# Altium schematic sheet BOARD_POWER.SchDoc: BOARD Power
size A4; Date: Not used; ApprovedBy: Not used; CheckedBy: Not used; Author: Not used; CompanyName: STMicroelectronics; DrawnBy: Not used; Engineer: Not used; Organization: Not used; Address1: Not used; Address2: Not used; Address3: Not used; Address4: Not used; DocumentNumber: Not used; Revision: Not used; SheetNumber: 14; SheetTotal: 16; CurrentTime: Not used; CurrentDate: Not used; Time: Not used; DocumentFullPathAndName: Not used; DocumentName: Not used; ModifiedDate: Not used; ImagePath: Not used; ProjectName: Not used; Application_BuildNumber: Not used
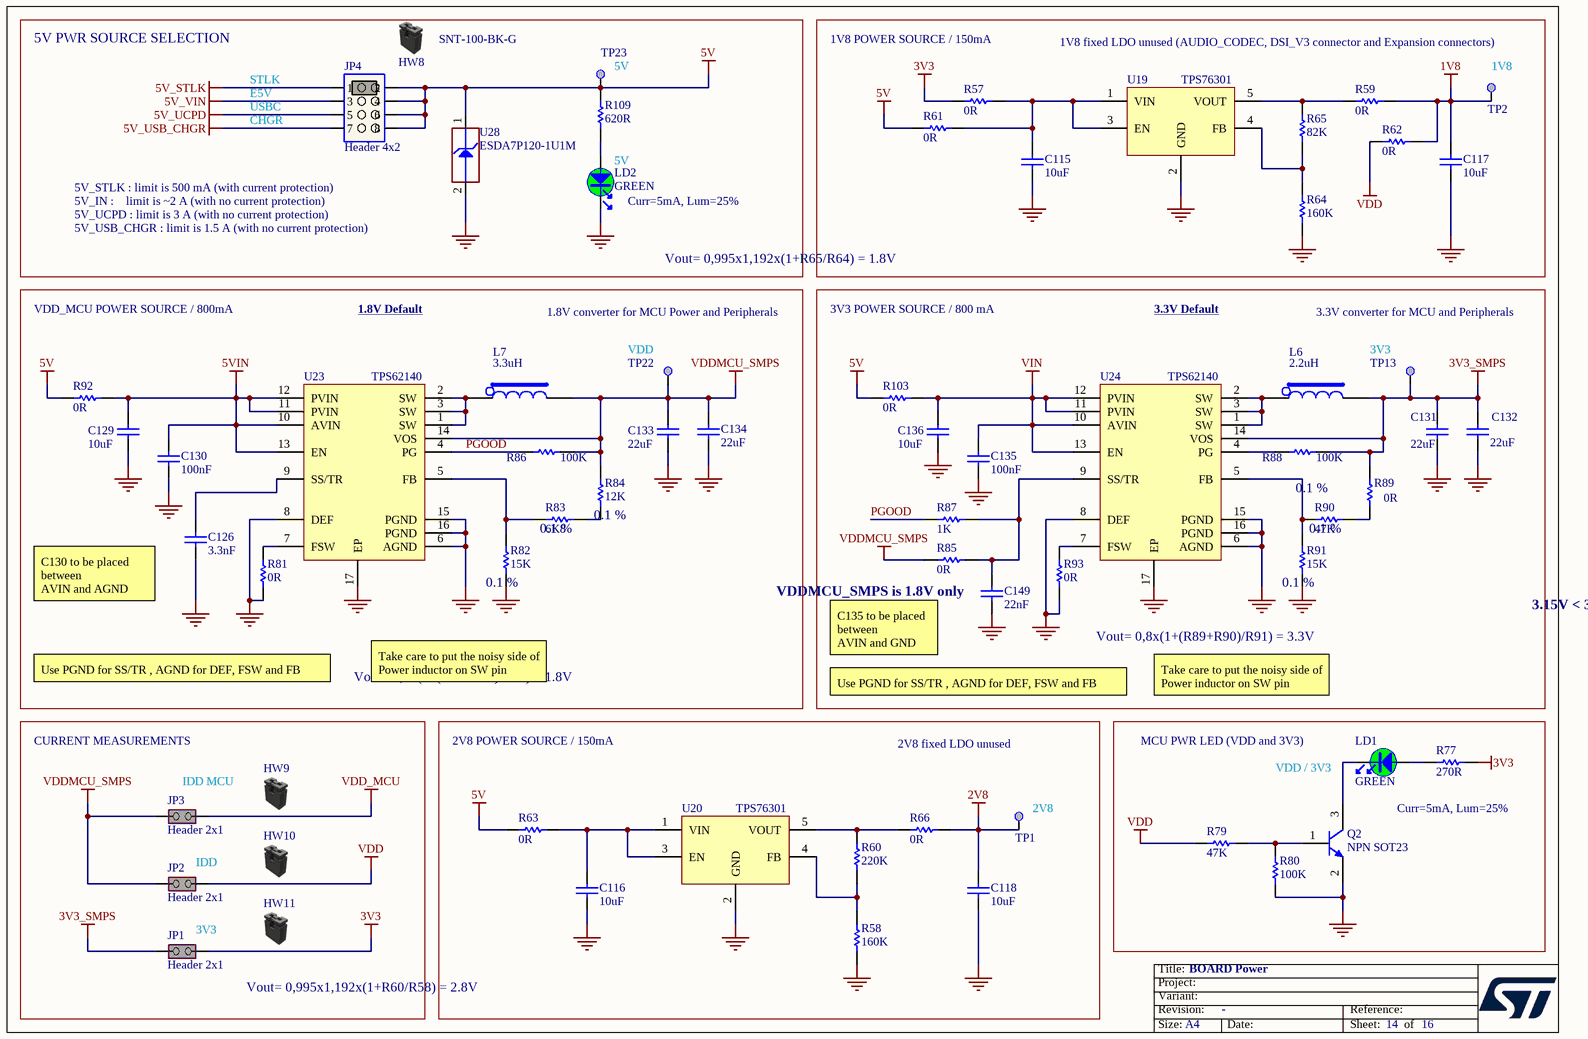
[diagram p0: BOARD_POWER.SchDoc]

## Parts
C115  value 10uF  [C0603_H0P8]  (hidden comment: Capacitor)
C116  value 10uF  [C0603_H0P8]  (hidden comment: Capacitor)
C117  value 10uF  [C0603_H0P8]  (hidden comment: Capacitor)
C118  value 10uF  [C0603_H0P8]  (hidden comment: Capacitor)
C126  value 3.3nF  [C0402]  (hidden comment: Capacitor)
C129  value 10uF  [C1206_H1P6]  (hidden comment: Capacitor)
C130  value 100nF  [C0402]  (hidden comment: Capacitor)
C131  value 22uF  [C0603_H0P8]  (hidden comment: Capacitor)
C132  value 22uF  [C0603_H0P8]  (hidden comment: Capacitor)
C133  value 22uF  [C0603_H0P8]  (hidden comment: Capacitor)
C134  value 22uF  [C0603_H0P8]  (hidden comment: Capacitor)
C135  value 100nF  [C0402]  (hidden comment: Capacitor)
C136  value 10uF  [C1206_H1P6]  (hidden comment: Capacitor)
C149  value 22nF  [C0402]  (hidden comment: Capacitor)
HW8  value SNT-100-BK-G  (hidden comment: Shunt Black 2.54mm)  (mechanical)
HW9  Shunt Black 2.54mm  (value not drawn)  (mechanical)
HW10  Shunt Black 2.54mm  (value not drawn)  (mechanical)
HW11  Shunt Black 2.54mm  (value not drawn)  (mechanical)
JP1  value Header 2x1  [CON_SAMTEC_TSW-102-07-G-S]  (hidden comment: Jumper_Header 2x1 Fitted)
JP2  value Header 2x1  [CON_SAMTEC_TSW-102-07-G-S]  (hidden comment: Jumper_Header 2x1 Fitted)
JP3  value Header 2x1  [CON_SAMTEC_TSW-102-07-G-S]  (hidden comment: Jumper_Header 2x1 Fitted)
JP4  value Header 4x2  [CON_SAMTEC_TSW-104-07-X-D]  (hidden comment: Jumper_Header 4x2 Fitted 1-2)
L6  value 2.2uH  [IND_COILCRAFT_XGL4020]  (hidden comment: INDUCTOR_POWER_WINDING)
L7  value 3.3uH  [IND_COILCRAFT_XGL4020]  (hidden comment: INDUCTOR_POWER_WINDING)
LD1  value GREEN  [LED_0603_OSRAM_LG-Q396-PS-35_GREEN_1A2K_H0P4]  (hidden comment: LED_green)
LD2  value GREEN  [LED_0603_OSRAM_LG-Q396-PS-35_GREEN_1A2K_H0P4]  (hidden comment: LED_green)
Q2  value NPN SOT23  [NPN_SOT23]  (hidden comment: 9013-SOT23)
R57  value 0R  [R0402]  (hidden comment: Resistor)
R58  value 160K  [R0402]  (hidden comment: Resistor)
R59  value 0R  [R0603]  (hidden comment: Resistor)
R60  value 220K  [R0402]  (hidden comment: Resistor)
R61  value 0R  [R0402]  (hidden comment: Resistor)
R62  value 0R  [R0603]  (hidden comment: Resistor)
R63  value 0R  [R0402]  (hidden comment: Resistor)
R64  value 160K  [R0402]  (hidden comment: Resistor)
R65  value 82K  [R0402]  (hidden comment: Resistor)
R66  value 0R  [R0603]  (hidden comment: Resistor)
R77  value 270R  [R0402]  (hidden comment: Resistor)
R79  value 47K  [R0603]  (hidden comment: Resistor)
R80  value 100K  [R0603]  (hidden comment: Resistor)
R81  value 0R  [R0402]  (hidden comment: Resistor)
R82  value 15K  [R0402]  (hidden comment: Resistor)
R83  value 6K8  [R0402]  (hidden comment: Resistor)
R84  value 12K  [R0402]  (hidden comment: Resistor)
R85  value 0R  [R0402]  (hidden comment: Resistor)
R86  value 100K  [R0402]  (hidden comment: Resistor)
R87  value 1K  [R0402]  (hidden comment: Resistor)
R88  value 100K  [R0402]  (hidden comment: Resistor)
R89  value 0R  [R0402]  (hidden comment: Resistor)
R90  value 47K  [R0402]  (hidden comment: Resistor)
R91  value 15K  [R0402]  (hidden comment: Resistor)
R92  value 0R  [R0603]  (hidden comment: Resistor)
R93  value 0R  [R0402]  (hidden comment: Resistor)
R103  value 0R  [R0603]  (hidden comment: Resistor)
R109  value 620R  [R0402]  (hidden comment: Resistor)
TP1  Test Point  [TP_SMD_1MM]  (value not drawn)  (no BOM)
TP2  Test Point  [TP_SMD_1MM]  (value not drawn)  (no BOM)
TP13  Test Point  [TP_SMD_1MM]  (value not drawn)  (no BOM)
TP22  Test Point  [TP_SMD_1MM]  (value not drawn)  (no BOM)
TP23  Test Point  [TP_SMD_1MM]  (value not drawn)  (no BOM)
U19  TPS76301  [ICC_SOT23-5L_H1P45]
U20  TPS76301  [ICC_SOT23-5L_H1P45]
U23  value TPS62140  [ICC_VQFN16-EPAD_3X3_P050]  (hidden comment: TPS62140RGTR)
U24  value TPS62140  [ICC_VQFN16-EPAD_3X3_P050]  (hidden comment: TPS62140RGTR)
U28  value ESDA7P120-1U1M  [ESD_QFN1610_2N_1K_2A]  (hidden comment: ESD-TRANSIL)

## Blocks framed on the sheet
5V PWR SOURCE SELECTION: JP4 LD2 R109 TP23 U28
Vout= 0,995x1,192x(1+R65/R64) = 1.8V: C115 C117 R57 R59 R61 R62 R64 R65 TP2 U19
VDDMCU_SMPS is 1.8V only: C126 C129 C130 C133 C134 L7 R81-R84 R86 R92 TP22 U23
3.15V < 3V3_SMPS typ. < 3.6V: C131 C132 C135 C136 C149 L6 R85 R87-R91 R93 R103 TP13 U24
Vout= 0,995x1,192x(1+R60/R58) = 2.8V: C116 C118 R58 R60 R63 R66 TP1 U20

## Nets
1V8: C117.2 R59.2 R62.2 TP2.1
2V8: C118.2 R66.2 TP1.1
3V3: JP1.2(NO) R57.1 R77.2
3V3_SMPS: C131.1 C132.2 JP1.1(COMMON) L6.2 R88.2 R89.2 TP13.1 U24.14(VOS)
5V: JP4.2 JP4.4 JP4.6 JP4.8 R61.1 R63.1 R92.1 R103.1 R109.2 TP23.1 U28.1(IO1)
5V_STLK: JP4.1
5V_UCPD: JP4.5
5V_USB_CHGR: JP4.7
5V_VIN: JP4.3
5VIN: C129.2 C130.2 R92.2 U23.10(AVIN) U23.11(PVIN) U23.12(PVIN) U23.13(EN)
GND: C115.1 C116.1 C117.1 C118.1 C126.1 C129.1 C130.1 C131.2 C132.1 C133.1 C134.1 C135.1 C136.1 C149.1 LD2.2 Q2.2(E) R58.1 R64.1 R80.1 R81.1 R82.1 R91.1 R93.1 U19.2(GND) U20.2(GND) U23.6(AGND) U23.8(DEF) U23.15(PGND) U23.16(PGND) U23.17(EP) U24.6(AGND) U24.8(DEF) U24.15(PGND) U24.16(PGND) U24.17(EP) U28.2(GND)
VDD: JP2.2(NO) R62.1 R79.1
VDD_MCU: JP3.2(NO)
VDDMCU_SMPS: C133.2 C134.2 JP2.1(COMMON) JP3.1(COMMON) L7.2 R84.1 R85.2 R86.2 TP22.1 U23.14(VOS)
VIN: C135.2 C136.2 R103.2 U24.10(AVIN) U24.11(PVIN) U24.12(PVIN) U24.13(EN)
PGOOD: R86.1 R87.2 U23.4(PG)
NetC115_2: C115.2 R57.2 R61.2 U19.1(VIN) U19.3(EN)
NetC116_2: C116.2 R63.2 U20.1(VIN) U20.3(EN)
NetC126_2: C126.2 U23.9(SS/TR)
NetC149_2: C149.2 R85.1 R87.1 U24.9(SS/TR)
NetL6_1: L6.1 U24.1(SW) U24.2(SW) U24.3(SW)
NetL7_1: L7.1 U23.1(SW) U23.2(SW) U23.3(SW)
NetLD1_1: LD1.1 R77.1
NetLD1_2: LD1.2 Q2.3(C)
NetLD2_1: LD2.1 R109.1
NetQ2_1: Q2.1(B) R79.2 R80.2
NetR58_2: R58.2 R60.1 U20.4(FB)
NetR59_1: R59.1 R65.2 U19.5(VOUT)
NetR60_2: R60.2 R66.1 U20.5(VOUT)
NetR64_2: R64.2 R65.1 U19.4(FB)
NetR81_2: R81.2 U23.7(FSW)
NetR82_2: R82.2 R83.1 U23.5(FB)
NetR83_2: R83.2 R84.2
NetR88_1: R88.1 U24.4(PG)
NetR89_1: R89.1 R90.2
NetR90_1: R90.1 R91.2 U24.5(FB)
NetR93_2: R93.2 U24.7(FSW)

## Notes on the sheet
- 1V8 POWER SOURCE / 150mA
- 1V8 fixed LDO unused (AUDIO_CODEC, DSI_V3 connector and Expansion connectors)
- STLK
- E5V
- USBC
- (near TP23) 5V
- (near TP2) 1V8
- CHGR
- (near LD2) 5V
- 5V_STLK : limit is 500 mA (with current protection)
- 5V_IN :    limit is ~2 A (with no current protection)
- 5V_UCPD : limit is 3 A (with no current protection)
- 5V_USB_CHGR : limit is 1.5 A (with no current protection)
- (near LD2) Curr=5mA, Lum=25%
- VDD_MCU POWER SOURCE / 800mA
- 1.8V Default
- 1.8V converter for MCU Power and Peripherals
- 3V3 POWER SOURCE / 800 mA
- 3.3V Default
- 3.3V converter for MCU and Peripherals
- (near TP22) VDD
- (near TP13) 3V3
- (near R83) 0.1 %
- (near R84) 0.1 %
- (near R89) 0.1 %
- (near R90) 0.1 %
- (near R82) 0.1 %
- (near R91) 0.1 %
- (near C126) C130 to be placed between
  AVIN and AGND
- C135 to be placed between
  AVIN and GND
- Vout= 0,8x(1+(R89+R90)/R91) = 3.3V
- Use PGND for SS/TR , AGND for DEF, FSW and FB
- Take care to put the noisy side of Power inductor on SW pin
- Vout= 0,8x(1+(R83+R84)/R82) = 1.8V
- CURRENT MEASUREMENTS
- IDD MCU
- 2V8 POWER SOURCE / 150mA
- 2V8 fixed LDO unused
- MCU PWR LED (VDD and 3V3)
- VDD / 3V3
- (near TP1) 2V8
- Curr=5mA, Lum=25%
- (near JP2) IDD
- (near JP1) 3V3
- Title:
- Project:
- Size:
- Revision:
- Variant:
- A4
- -
- Date:
- Reference:
- Sheet:
- of

## Library data of the parts
C115-C118 = MCD-02605: Capacitor, MLCC, 10uF, 10V, X5R, +/-10%, 0603, T=0.8mm; Part_Preference: Recommended; Manufacturer: YAGEO; Manufacturer_Part_Number: CC0603KRX5R6BB106; Order_Code_RS: 2006536; Internal_Part_Number: MCD-02605; Status: Checked; Part_Type: Capacitor; Package: 0603; ComponentLink1URL: http://tunmcdsvn.tun.st.com/Component_Documentation_Library/Trunk/Capacitor/YAGEO_X5R_Series; Order_Code_Digikey: 311-1782-2-ND; Order_Code_Farnell: 3759761
C126 = MCD-02628: Capacitor, MLCC, 3.3nF, 50V, X7R, +/-10%, 0402, T=0.5mm; Part_Preference: Recommended; Manufacturer: YAGEO; Manufacturer_Part_Number: CC0402KRX7R9BB332; Order_Code_RS: 1992260; Internal_Part_Number: MCD-02628; Status: New; Part_Type: Capacitor; Package: 0402; ComponentLink1URL: http://tunmcdsvn.tun.st.com/Component_Documentation_Library/Trunk/Capacitor/YAGEO_X7R_Series; Order_Code_Digikey: 311-1034-2-ND; Order_Code_Farnell: 2370654
C129 C136 = MCD-02610: Capacitor, MLCC, 10uF, 25V, X5R, +/-10%, 1206, T=1.6mm; Part_Preference: Recommended; Manufacturer: YAGEO; Manufacturer_Part_Number: CC1206KKX5R8BB106; Order_Code_RS: 1991983; Internal_Part_Number: MCD-02610; Status: Checked; Part_Type: Capacitor; Package: 1206; ComponentLink1URL: http://tunmcdsvn.tun.st.com/Component_Documentation_Library/Trunk/Capacitor/YAGEO_X5R_Series; Order_Code_Digikey: N/A; Order_Code_Farnell: 3366655
C130 C135 = MCD-00006: Capacitor, MLCC, 100nF, 16V, X7R, +/-10%, 0402, T=0.5mm; Part_Preference: Recommended; Manufacturer: YAGEO; Manufacturer_Part_Number: CC0402KRX7R7BB104; Order_Code_RS: 616-9701; Component_Country_Of_Origin: China; Internal_Part_Number: MCD-00006; Status: Released; Part_Type: Capacitor; Package: 0402; ComponentLink1URL: http://tunmcdsvn.tun.st.com/Component_Documentation_Library/Trunk/Capacitor/YAGEO_X7R_Series; Order_Code_Digikey: 311-1338-1-ND; Order_Code_Farnell: 9402047
C131-C134 = MCD-02607: Capacitor, MLCC, 22uF, 10V, X5R, +/-20%, 0603, T=0.8mm; Part_Preference: Recommended; Manufacturer: YAGEO; Manufacturer_Part_Number: CC0603MRX5R6BB226; Order_Code_RS: 2006627; Internal_Part_Number: MCD-02607; Status: Checked; Part_Type: Capacitor; Package: 0603; ComponentLink1URL: http://tunmcdsvn.tun.st.com/Component_Documentation_Library/Trunk/Capacitor/YAGEO_X5R_Series; Order_Code_Digikey: 311-1819-2-ND; Order_Code_Farnell: N/A
C149 = MCD-03051: Capacitor, MLCC, 22nF, 50V, X7R, +/-10%, 0402, T=0.5mm; Part_Preference: Recommended; Manufacturer: YAGEO; Manufacturer_Part_Number: CC0402KRX7R9BB223; Order_Code_RS: NA; ShowFields: YES; ID: 5167; Internal_Part_Number: MCD-03051; Status: New; Part_Type: Capacitor; Package: 0402; ComponentLink1URL: http://tunmcdsvn.tun.st.com/Component_Documentation_Library/Trunk/Capacitor/YAGEO_X7R_Series; Order_Code_Digikey: 311-1722-2-ND; Order_Code_Farnell: 3366470
HW8 = MCD-00043: SHUNT 2.54mm BLACK; Part_Type: Misc; Manufacturer: SAMTEC; Part_Preference: Recommended; Component_Country_Of_Origin: China, Costa Rica, Malaysia, United States, Vietnam; Internal_Part_Number: MCD-00043; Status: Released; Manufacturer_Part_Number: SNT-100-BK-G; ComponentLink1URL: http://tunmcdsvn.tun.st.com/Component_Datasheet_Library/Trunk/Connectors/Samtec_Shunt_Jumper_SNT100
HW9-HW11 = MCD-00043: SHUNT 2.54mm BLACK; Part_Type: Misc; Manufacturer: SAMTEC; Part_Preference: Recommended; Value: SNT-100-BK-G; Component_Country_Of_Origin: China, Costa Rica, Malaysia, United States, Vietnam; Internal_Part_Number: MCD-00043; Status: Released; Manufacturer_Part_Number: SNT-100-BK-G; ComponentLink1URL: http://tunmcdsvn.tun.st.com/Component_Datasheet_Library/Trunk/Connectors/Samtec_Shunt_Jumper_SNT100
JP1-JP3 = MCD-00683: Header, 2x1, 2.54mm, VR, TH, T=5.84mm/2.54mm; Part_Type: Connector; Manufacturer: SAMTEC; Manufacturer_Part_Number: TSW-102-07-G-S; Part_Preference: Recommended; Order_Code_RS: 155-5312; Component_Country_Of_Origin: China, Costa Rica, Malaysia, United States, Vietnam; Internal_Part_Number: MCD-00683; Status: Released; ComponentLink1URL: http://tunmcdsvn.tun.st.com/Component_Documentation_Library/Trunk/Connector/SAMTEC_TSW_Series/; Order_Code_Digikey: SAM1029-02-ND; Order_Code_Farnell: 2505044
JP4 = MCD-00686: Header, 4x2, 2.54mm, VR, TH, T=5.84mm/2.54mm; Part_Type: Connector; Manufacturer_Part_Number: TSW-104-07-G-D; Manufacturer: SAMTEC; Part_Preference: Recommended; Order_Code_RS: 161-2260; Component_Country_Of_Origin: China, Costa Rica, Malaysia, United States, Vietnam; Internal_Part_Number: MCD-00686; Status: Released; ComponentLink1URL: http://tunmcdsvn.tun.st.com/Component_Documentation_Library/Trunk/Connector/SAMTEC_TSW_Series/; Order_Code_Digikey: SAM1028-04-ND; Order_Code_Farnell: 2856692
L6 = MCD-02582: Inductor, 2.2uH, +/-20%, 8.9A, 0R022, 4x4mm, T=2.1mm; Part_Preference: Recommended; Manufacturer: COILCRAFT; Manufacturer_Part_Number: XGL4020-222MED; ShowFields: YES; ID: 4688; Internal_Part_Number: MCD-02582; Status: Checked; Part_Type: Inductor; ComponentLink1URL: http://tunmcdsvn.tun.st.com/Component_Documentation_Library/Trunk/Inductor/COILCRAFT_XGL4020_Series; Order_Code_Digikey: N/A; Order_Code_Farnell: N/A; Order_Code_RS: N/A
L7 = MCD-02581: Inductor, 3.3uH, +/-20%, 6.6A, 0R034, 4x4mm, T=2.1mm; Part_Preference: Recommended; Manufacturer: COILCRAFT; Manufacturer_Part_Number: XGL4020-332MED; ShowFields: YES; ID: 4687; Internal_Part_Number: MCD-02581; Status: Checked; Part_Type: Inductor; ComponentLink1URL: http://tunmcdsvn.tun.st.com/Component_Documentation_Library/Trunk/Inductor/COILCRAFT_XGL4020_Series; Order_Code_Digikey: N/A; Order_Code_Farnell: N/A; Order_Code_RS: N/A
LD1 LD2 = MCD-00588: LED Green, 0603 SMD, Forward Voltage Typ=2V, Max=2.5V; Part_Type: Display; Manufacturer: OSRAM OPTO SEMICONDUCTORS; Manufacturer_Part_Number: LG Q396-PS-35; Part_Preference: Recommended; Alternate_Internal_Part_Number: MCD-02400; Component_Country_Of_Origin: Unknown; ShowFields: YES; ID: 3155; Internal_Part_Number: MCD-00588; Status: Released; Package: LED 0603; ComponentLink1URL: http://tunmcdsvn.tun.st.com/Component_Datasheet_Library/Trunk/Display/OSRAM_LED_GREEN_LG Q396-PS-35; Order_Code_Digikey: LG Q396-PS-35-ND
Q2 = MCD-00073: NPN Bipolar Transistor; Part_Type: IC; Manufacturer_Part_Number: BSR14; Manufacturer: ON SEMICONDUCTOR; Part_Preference: Recommended; Component_Country_Of_Origin: Unknown; Revision: *; Internal_Part_Number: MCD-00073; Status: Released; ComponentLink1URL: http://tunmcdsvn.tun.st.com/Component_Datasheet_Library/Trunk/IC/NXP_Transistor_BSR14; Package: SOT23
R57 R61 R63 R81 R85 R93 = MCD-00052: Resistor, 0R, 0402, +/-5%, 1/16W; Part_Preference: Recommended; Manufacturer: YAGEO; Manufacturer_Part_Number: RC0402JR-070RL; Order_Code_RS: 618-5804; Component_Country_Of_Origin: China; Internal_Part_Number: MCD-00052; Status: Released; Part_Type: Resistor; Package: 0402; ComponentLink1URL: http://tunmcdsvn.tun.st.com/Component_Documentation_Library/Trunk/Resistor/YAGEO_RC_L_Series; Order_Code_Digikey: 311-0.0JRCT-ND; Order_Code_Farnell: 9232516RL
R58 R64 = MCD-00405: Resistor, 160K, 0402, +/-1%, 1/16W; Part_Preference: Recommended; Manufacturer: YAGEO; Manufacturer_Part_Number: RC0402FR-07160KL; Component_Country_Of_Origin: China; Internal_Part_Number: MCD-00405; Status: Released; Part_Type: Resistor; Package: 0402; ComponentLink1URL: http://tunmcdsvn.tun.st.com/Component_Documentation_Library/Trunk/Resistor/YAGEO_RC_L_Series; Order_Code_Digikey: YAG2996CT-ND; Order_Code_Farnell: 2140947; Order_Code_RS: N/A
R59 R62 R66 R92 R103 = MCD-00181: Resistor, 0R, 0603, +/- 0.5mR, 1/4W; Part_Preference: Recommended; Manufacturer: ROHM; Manufacturer_Part_Number: PMR03EZPJ000; Component_Country_Of_Origin: Philippines, Thailand; Internal_Part_Number: MCD-00181; Status: Released; Part_Type: Resistor; Package: 0603; ComponentLink1URL: http://tunmcdsvn.tun.st.com/Component_Documentation_Library/Trunk/Resistor/ROHM_PMR_Series; Order_Code_Digikey: PMR03EZPJ000-ND; Order_Code_Farnell: N/A; Order_Code_RS: N/A
R60 = MCD-00164: Resistor, 220K, 0402, +/-1%, 1/16W; Part_Preference: Recommended; Manufacturer: YAGEO; Manufacturer_Part_Number: RC0402FR-07220KL; Component_Country_Of_Origin: China; Internal_Part_Number: MCD-00164; Status: Released; Part_Type: Resistor; Package: 0402; ComponentLink1URL: http://tunmcdsvn.tun.st.com/Component_Documentation_Library/Trunk/Resistor/YAGEO_RC_L_Series; Order_Code_Digikey: 311-220KLRCT-ND; Order_Code_Farnell: 9239510; Order_Code_RS: N/A
R65 = MCD-00531: Resistor, 82K, 0402, +/-1%, 1/16W; Part_Preference: Recommended; Manufacturer: YAGEO; Manufacturer_Part_Number: RC0402FR-0782KL; Component_Country_Of_Origin: China; Internal_Part_Number: MCD-00531; Status: Released; Part_Type: Resistor; Package: 0402; ComponentLink1URL: http://tunmcdsvn.tun.st.com/Component_Documentation_Library/Trunk/Resistor/YAGEO_RC_L_Series; Order_Code_Digikey: 311-82.0KLRCT-ND; Order_Code_Farnell: 9239464; Order_Code_RS: N/A
R77 = MCD-00441: Resistor, 270R, 0402, +/-1%, 1/16W; Manufacturer: YAGEO; Manufacturer_Part_Number: RC0402FR-07270RL; Part_Preference: Recommended; Component_Country_Of_Origin: China; ShowFields: YES; ID: 2838; Internal_Part_Number: MCD-00441; Status: Released; Part_Type: Resistor; Package: 0402; ComponentLink1URL: http://tunmcdsvn.tun.st.com/Component_Documentation_Library/Trunk/Resistor/YAGEO_RC_L_Series; Order_Code_Digikey: 311-270LRCT-ND; Order_Code_Farnell: 9239162; Order_Code_RS: N/A
R79 = MCD-00222: Resistor, 47K, 0603, 1%, 1/10W; Manufacturer_Part_Number: RC0603FR-0747KL; Manufacturer: YAGEO; Part_Preference: Recommended; Component_Country_Of_Origin: China; Internal_Part_Number: MCD-00222; Status: Released; Part_Type: Resistor; Package: 0603; ComponentLink1URL: http://tunmcdsvn.tun.st.com/Component_Documentation_Library/Trunk/Resistor/YAGEO_RC_L_Series; Order_Code_Digikey: 311-47.0KHRCT-ND; Order_Code_Farnell: 9238689; Order_Code_RS: N/A
R80 = MCD-00223: Resistor, 100K, 0603, +/- 1%, 1/10W; Manufacturer_Part_Number: RC0603FR-07100KL; Manufacturer: YAGEO; Part_Preference: Recommended; Component_Country_Of_Origin: China; Internal_Part_Number: MCD-00223; Status: Released; Part_Type: Resistor; Package: 0603; ComponentLink1URL: http://tunmcdsvn.tun.st.com/Component_Documentation_Library/Trunk/Resistor/YAGEO_RC_L_Series; Order_Code_Digikey: 311-100KHRTR-ND; Order_Code_Farnell: 2421851; Order_Code_RS: N/A
R82 R91 = MCD-02570: Resistor, 15K, 0402, +/-0.1%, 1/16W, +/-25ppm/°C; Part_Preference: Recommended; Manufacturer: YAGEO; Manufacturer_Part_Number: RT0402BRD0715KL; Order_Code_RS: 1991284; Internal_Part_Number: MCD-02570; Status: Checked; Part_Type: Resistor; Package: 0402; ComponentLink1URL: http://tunmcdsvn.tun.st.com/Component_Documentation_Library/Trunk/Resistor/YAGEO_RT_Series/; Order_Code_Digikey: YAG2302TR-ND; Order_Code_Farnell: 3496464
R83 = MCD-02568: Resistor, 6K8, 0402, +/-0.1%, 1/16W, +/-25ppm/°C; Part_Preference: Recommended; Manufacturer: YAGEO; Manufacturer_Part_Number: RT0402BRD076K8L; Order_Code_RS: 1991364; Internal_Part_Number: MCD-02568; Status: Checked; Part_Type: Resistor; Package: 0402; ComponentLink1URL: http://tunmcdsvn.tun.st.com/Component_Documentation_Library/Trunk/Resistor/YAGEO_RT_Series/; Order_Code_Digikey: YAG1473TR-ND; Order_Code_Farnell: 3496534RL
R84 = MCD-02567: Resistor, 12K, 0402, +/-0.1%, 1/16W, +/-25ppm/°C; Part_Preference: Recommended; Manufacturer: YAGEO; Manufacturer_Part_Number: RT0402BRD0712KL; Internal_Part_Number: MCD-02567; Status: Checked; Part_Type: Resistor; Package: 0402; ComponentLink1URL: http://tunmcdsvn.tun.st.com/Component_Documentation_Library/Trunk/Resistor/YAGEO_RT_Series/; Order_Code_Digikey: YAG1354TR-ND; Order_Code_Farnell: 3496461RL; Order_Code_RS: N/A
R86 R88 = MCD-00059: Resistor, 100K, 0402, +/-1%, 1/16W; Part_Preference: Recommended; Manufacturer: YAGEO; Manufacturer_Part_Number: RC0402FR-07100KL; Component_Country_Of_Origin: China; Internal_Part_Number: MCD-00059; Status: Released; Part_Type: Resistor; Package: 0402; ComponentLink1URL: http://tunmcdsvn.tun.st.com/Component_Documentation_Library/Trunk/Resistor/YAGEO_RC_L_Series; Order_Code_Digikey: 311-100KLRTR-ND; Order_Code_Farnell: 2421891; Order_Code_RS: N/A
R87 = MCD-00061: Resistor, 1K, 0402, +/-1%,1/16W; Part_Preference: Recommended; Manufacturer: YAGEO; Manufacturer_Part_Number: RC0402FR-071KL; Component_Country_Of_Origin: China; ShowFields: YES; ID: 2532; Internal_Part_Number: MCD-00061; Status: Released; Part_Type: Resistor; Package: 0402; ComponentLink1URL: http://tunmcdsvn.tun.st.com/Component_Documentation_Library/Trunk/Resistor/YAGEO_RC_L_Series; Order_Code_Digikey: 311-1.00KLRCT-ND; Order_Code_Farnell: 9239235; Order_Code_RS: N/A
R89 = MCD-00052: Resistor, 0R, 0402, +/-5%, 1/16W; Part_Preference: Recommended; Manufacturer: YAGEO; Manufacturer_Part_Number: RC0402JR-070RL; Order_Code_RS: 618-5804; Component_Country_Of_Origin: China; ShowFields: YES; ID: 2540; Internal_Part_Number: MCD-00052; Status: Released; Part_Type: Resistor; Package: 0402; ComponentLink1URL: http://tunmcdsvn.tun.st.com/Component_Documentation_Library/Trunk/Resistor/YAGEO_RC_L_Series; Order_Code_Digikey: 311-0.0JRCT-ND; Order_Code_Farnell: 9232516RL
R90 = MCD-02550: Resistor, 47K, 0402, +/-0.1%, 1/16W, +/-25ppm/°C; Part_Preference: Recommended; Manufacturer: YAGEO; Manufacturer_Part_Number: RT0402BRD0747KL; Order_Code_RS: 1991342; Internal_Part_Number: MCD-02550; Status: Checked; Part_Type: Resistor; Package: 0402; ComponentLink1URL: http://tunmcdsvn.tun.st.com/Component_Documentation_Library/Trunk/Resistor/YAGEO_RT_Series/; Order_Code_Digikey: YAG1438TR-ND; Order_Code_Farnell: 3496517RL
R109 = MCD-00499: Resistor, 620R, 0402, +/-1%, 1/16W; Manufacturer: YAGEO; Manufacturer_Part_Number: RC0402FR-07620RL; Part_Preference: Recommended; Component_Country_Of_Origin: China; ShowFields: YES; ID: 2781; Internal_Part_Number: MCD-00499; Status: Released; Part_Type: Resistor; Package: 0402; ComponentLink1URL: http://tunmcdsvn.tun.st.com/Component_Documentation_Library/Trunk/Resistor/YAGEO_RC_L_Series; Order_Code_Digikey: 311-620LRCT-ND; Order_Code_Farnell: 1458815; Order_Code_RS: N/A
TP1 TP2 TP13 TP22 TP23 = MCD-00074: Test Point 1mm; Part_Type: Misc; Part_Preference: Recommended; Internal_Part_Number: MCD-00074; Status: Released; Manufacturer_Part_Number: N/A; Manufacturer: N/A; ComponentLink1URL: http://na; Order_Code_Digikey: N/A; Order_Code_Farnell: N/A; Order_Code_RS: N/A
U19 U20 = MCD-02175: LDO VOLTAGE REGULATOR, Adjustable, 150mA,; Part_Type: IC; Manufacturer_Part_Number: TPS76301DBVT; Manufacturer: TEXAS INSTRUMENTS; Part_Preference: Recommended; Component_Country_Of_Origin: China; Internal_Part_Number: MCD-02175; Value: TPS76301; Status: Checked; Package: SOT23-5; ComponentLink1URL: http://tunmcdsvn.tun.st.com/Component_Datasheet_Library/Trunk/IC/TI_LDO_TPS763xx-series; Order_Code_Digikey: 296-2698-1-ND; Order_Code_Farnell: N/A; Order_Code_RS: N/A
U23 U24 = MCD-02580: Buck converter, 2A, 3V to 17V input, Fsw 1.25/2.5 MHz, 3x3 VQFN16; Part_Type: IC; Part_Preference: Recommended; Manufacturer: TEXAS INSTRUMENTS; Internal_Part_Number: MCD-02580; Status: Checked; Manufacturer_Part_Number: TPS62140RGTR; ComponentLink1URL: http://tunmcdsvn.tun.st.com/Component_Documentation_Library/Trunk/IC/TEXAS_INSTRUMENTS_TPS6214x_Series; Order_Code_Digikey: 296-37683-2-ND; Order_Code_Farnell: 3007429RL; Order_Code_RS: N/A
U28 = MCD-01026: High power transient voltage suppressor; Part_Type: Diode; Manufacturer: STMICROELECTRONICS; BMS_Part_Number: 9179046; Part_Preference: Recommended; Manufacturer_HQ_COO: EU; Component_Country_Of_Origin: China; Internal_Part_Number: MCD-01026; Status: Released; Manufacturer_Part_Number: ESDA7P120-1U1M; Package: QFN1610; ComponentLink1URL: http://tunmcdsvn.tun.st.com/Component_Datasheet_Library/Trunk/Diodes/STM_ESD_ESDA7P120-1U1M